# Altium project PortableSDVX.PrjPcb
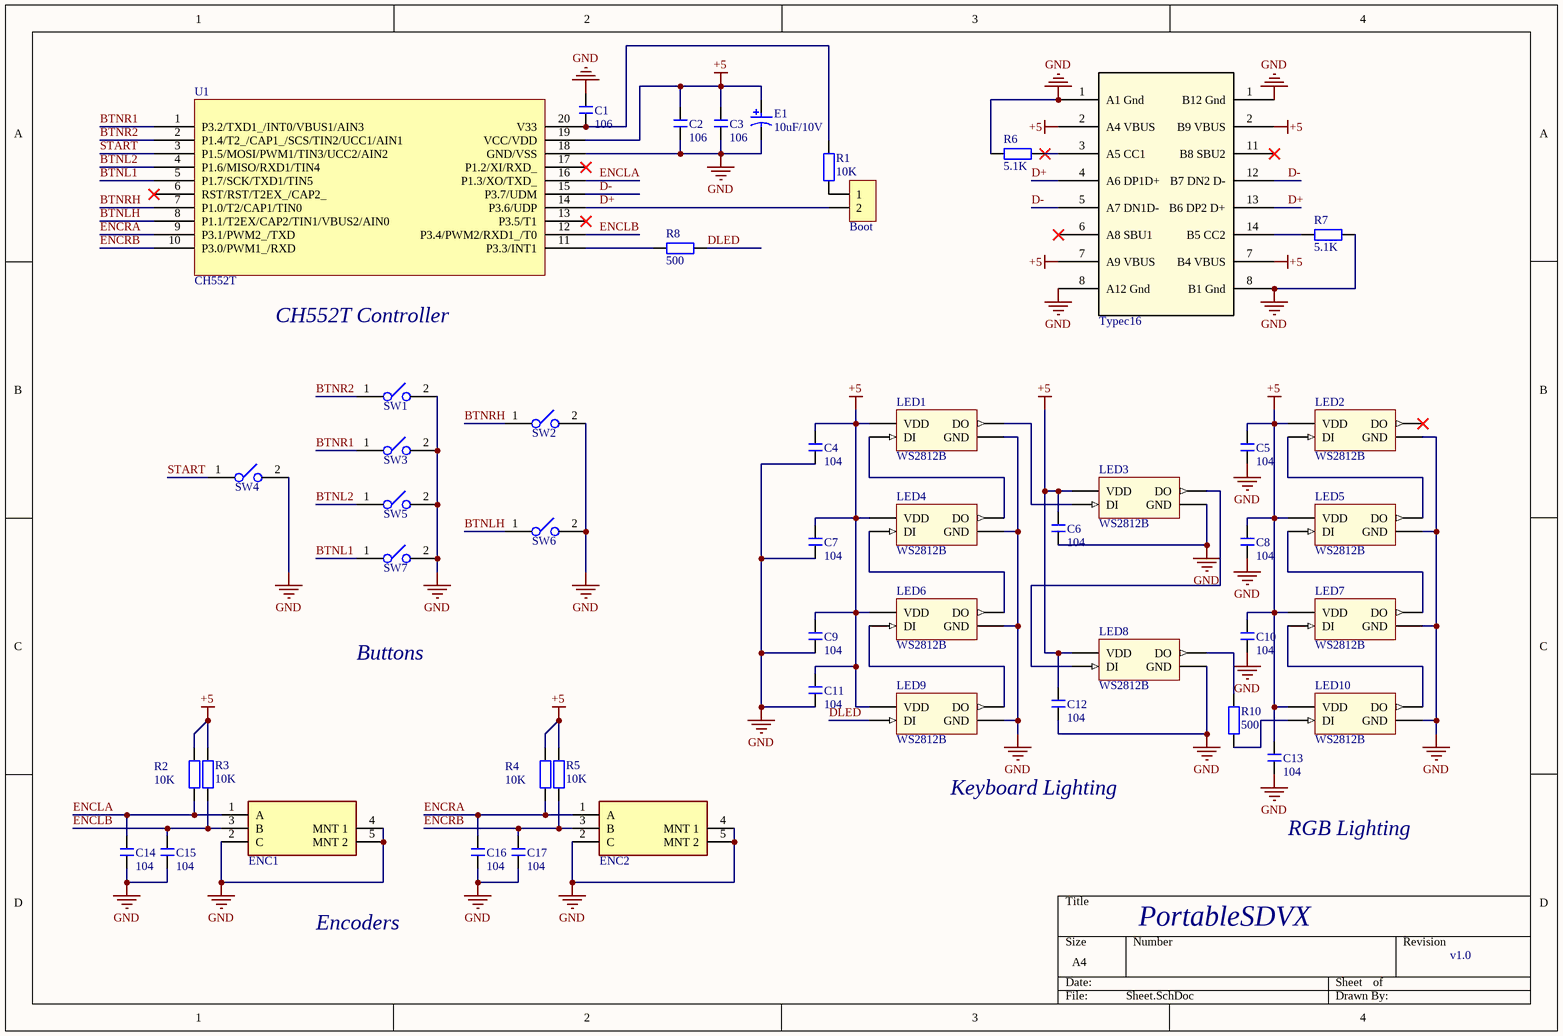
[diagram p0: Sheet.SchDoc]
1 sheet, 49 parts. Net scope: global (net labels, ports and power ports of the same name join across sheets).
Board file: PCB.PcbDoc

## Sheet Sheet.SchDoc
size A4; Author: tjljw2000; DrawnBy: tjljw2000

### Parts
Boot  HDR-1X2  [HDR-1X2]  (value not drawn)
C1  106  [C 0805]
C2  106  [C 0805]
C3  106  [C 0805]
C4  104  [C 0603]
C5  104  [C 0603]
C6  104  [C 0603]
C7  104  [C 0603]
C8  104  [C 0603]
C9  104  [C 0603]
C10  104  [C 0603]
C11  104  [C 0603]
C12  104  [C 0603]
C13  104  [C 0603]
C14  104  [C 0603]
C15  104  [C 0603]
C16  104  [C 0603]
C17  104  [C 0603]
E1  10uF/10V  [CD B(3528)]
ENC1  EC12E24204A9  [ALPS_EC12E24204A9_MFG]  (value not drawn)
ENC2  EC12E24204A9  [ALPS_EC12E24204A9_MFG]  (value not drawn)
J1  Typec16  [typec 16p]
LED1  WS2812B  [WS2812_sink]
LED2  WS2812B  [WS2812B]
LED3  WS2812B  [WS2812_sink]
LED4  WS2812B  [WS2812_sink]
LED5  WS2812B  [WS2812B]
LED6  WS2812B  [WS2812_sink]
LED7  WS2812B  [WS2812B]
LED8  WS2812B  [WS2812_sink]
LED9  WS2812B  [WS2812_sink]
LED10  WS2812B  [WS2812B]
R1  10K  [Res-SMD-0603]
R2  10K  [Res-SMD-0603]
R3  10K  [Res-SMD-0603]
R4  10K  [Res-SMD-0603]
R5  10K  [Res-SMD-0603]
R6  5.1K  [Res-SMD-0603]
R7  5.1K  [Res-SMD-0603]
R8  500  [Res-SMD-0603]
R10  500  [Res-SMD-0603]
SW1  SWITCH  [Cherry_MX1A_Kailh]  (value not drawn)
SW2  SWITCH  [Cherry_MX1A_X2_Kailh]  (value not drawn)
SW3  SWITCH  [Cherry_MX1A_Kailh]  (value not drawn)
SW4  SWITCH  [Cherry_MX1A_Kailh]  (value not drawn)
SW5  SWITCH  [Cherry_MX1A_Kailh]  (value not drawn)
SW6  SWITCH  [Cherry_MX1A_X2_Kailh]  (value not drawn)
SW7  SWITCH  [Cherry_MX1A_Kailh]  (value not drawn)
U1  CH552T  [TSSOP20_N]

### Nets
+5: C2.2 C3.2 C4.2 C5.2 C6.2 C7.2 C8.2 C9.2 C10.2 C11.2 C12.2 C13.2 E1.A J1.2(A4_VBUS) J1.7(A9_VBUS) LED1.1(VDD) LED2.1(VDD) LED3.1(VDD) LED4.1(VDD) LED5.1(VDD) LED6.1(VDD) LED7.1(VDD) LED8.1(VDD) LED9.1(VDD) LED10.1(VDD) R2.2 R3.2 R4.2 R5.2 U1.19(VCC/VDD)
GND: C1.2 C2.1 C3.1 C4.1 C5.1 C6.1 C7.1 C8.1 C9.1 C10.1 C11.1 C12.1 C13.1 C14.1 C15.1 C16.1 C17.1 E1.K ENC1.2(C) ENC1.4(MNT_1) ENC1.5(MNT_2) ENC2.2(C) ENC2.4(MNT_1) ENC2.5(MNT_2) J1.1(A1_Gnd) J1.8(A12_Gnd) LED1.3(GND) LED2.3(GND) LED3.3(GND) LED4.3(GND) LED5.3(GND) LED6.3(GND) LED7.3(GND) LED8.3(GND) LED9.3(GND) LED10.3(GND) R6.2 R7.1 SW1.2 SW2.2 SW3.2 SW4.2 SW5.2 SW6.2 SW7.2 U1.18(GND/VSS)
BTNL1: SW7.1 U1.5(P1.7/SCK/TXD1/TIN5)
BTNL2: SW5.1 U1.4(P1.6/MISO/RXD1/TIN4)
BTNLH: SW6.1 U1.8(P1.1/T2EX/CAP2/TIN1/VBUS2/AIN0)
BTNR1: SW3.1 U1.1(P3.2/TXD1_/INT0/VBUS1/AIN3)
BTNR2: SW1.1 U1.2(P1.4/T2_/CAP1_/SCS/TIN2/UCC1/AIN1)
BTNRH: SW2.1 U1.7(P1.0/T2/CAP1/TIN0)
D+: Boot.2 J1.4(A6_DP1D+) J1.13(B6_DP2_D+) U1.14(P3.6/UDP)
D-: J1.5(A7_DN1D-) J1.12(B7_DN2_D-) U1.15(P3.7/UDM)
DLED: LED9.4(DI) R8.2
ENCLA: C14.2 ENC1.1(A) R2.1 U1.16(P1.3/XO/TXD_)
ENCLB: C15.2 ENC1.3(B) R3.1 U1.12(P3.4/PWM2/RXD1_/T0)
ENCRA: C16.2 ENC2.1(A) R4.1 U1.9(P3.1/PWM2_/TXD)
ENCRB: C17.2 ENC2.3(B) R5.1 U1.10(P3.0/PWM1_/RXD)
START: SW4.1 U1.3(P1.5/MOSI/PWM1/TIN3/UCC2/AIN2)
NetBoot_1: Boot.1 R1.1
NetC1_1: C1.1 R1.2 U1.20(V33)
NetJ1_3: J1.3(A5_CC1) R6.1
NetJ1_14: J1.14(B5_CC2) R7.2
NetLED1_2: LED1.2(DO) LED3.4(DI)
NetLED1_4: LED1.4(DI) LED4.2(DO)
NetLED2_4: LED2.4(DI) LED5.2(DO)
NetLED3_2: LED3.2(DO) LED8.4(DI)
NetLED4_4: LED4.4(DI) LED6.2(DO)
NetLED5_4: LED5.4(DI) LED7.2(DO)
NetLED6_4: LED6.4(DI) LED9.2(DO)
NetLED7_4: LED7.4(DI) LED10.2(DO)
NetLED8_2: LED8.2(DO) R10.2
NetLED10_4: LED10.4(DI) R10.1
NetR8_1: R8.1 U1.11(P3.3/INT1)

Not connected (* = marked no-connect by the designer): J1 6(A8_SBU1)* 11(B8_SBU2)*; LED2 2(DO)*; U1 6(RST/RST/T2EX_/CAP2_)* 13(P3.5/T1)* 17(P1.2/XI/RXD_)*

### Notes on the sheet
- CH552T Controller
- Buttons
- Keyboard Lighting
- RGB Lighting
- Encoders
- PortableSDVX
- v1.0

### Library data of the parts
Boot = Header 2: 2P接插件; 版权归属: 源创客; BOM名称: 2P接插件; 学习资源: www.ooocke.com
C1-C17 = Cap-CER-SMD: 瓷片电容-贴片
E1 = Cap-TAN-SMD: 钽电解电容-贴片
LED1-LED10 = WS2812B: Raspberry Pi HAT _40 pin_ Wheeled Robotics Kit; MF: SparkFun Electronics; Availability: Unavailable; SnapEDA_Link: https://www.snapeda.com/parts/WS2812B/Worldsemi/view-part/1038297/?ref=snap; MP: WS2812B; Price: None; Value: *; Package: None
R1-R8 R10 = Res-Fixed-SMD: 固定电阻器-贴片
SW1-SW7 = SWITCH: SWITCH Pushbutton Switch SPST-NO Keyswitch Through Hole; Manufacturer: Cherry; Category 8Ce341E9Bf4C5724: Switches; size_length: 15.6 mm; contact_current_rating: 10 mA; Category Db391633E8F300Fe: Industrial Control; Category 6A0Ba70159B8B1Cc: Keylock; contact_plating: Gold; Category A9A064Aa9A0A7267: Tactile / Jog; contacts_type: SPST; Num Pins: 2; Category 6E88A3825D3Cb54F: Uncategorized; helpURL: https://upverter.com/upn/revision/2ca27a2fbe391082/; ComponentLink2Description: Datasheet; Temperature: -10 to +70; Package: SW_15MM6_15_6; Supplier 2: Mouser; Price: 0.648391469733; Supplier 1: Digi-Key; ComponentLink1URL: https://upverter.com/upn/revision/2ca27a2fbe391082/; Supplier Part Number 2: 540-MX1A-11NW; Supplier Part Number 1: CH160-ND; ComponentLink1Description: Upverter; ComponentLink2URL: https://upverter.com/datasheet/a174b925b05052267a652262a41f429ea7a87855.pdf; RoHS: TRUE; Mouser Part Number: 540-MX1A-11NW; orientation: Vertical; Temperature Range High: +70; Octopart Part Number: MX1A-11NW; Digikey Description: SWITCH Pushbutton Switch SPST-NO Keyswitch Through Hole; Digikey Part Number: CH160-ND; Lead Free: yes; Temperature Range Low: -10; Category 2Bfae6F01857F03D: Pushbutton; Mounting Type: lug; size_width: 15.6 mm